# Altium schematic sheet Switch.SchDoc
size A; SheetNumber: 8; SheetTotal: 12
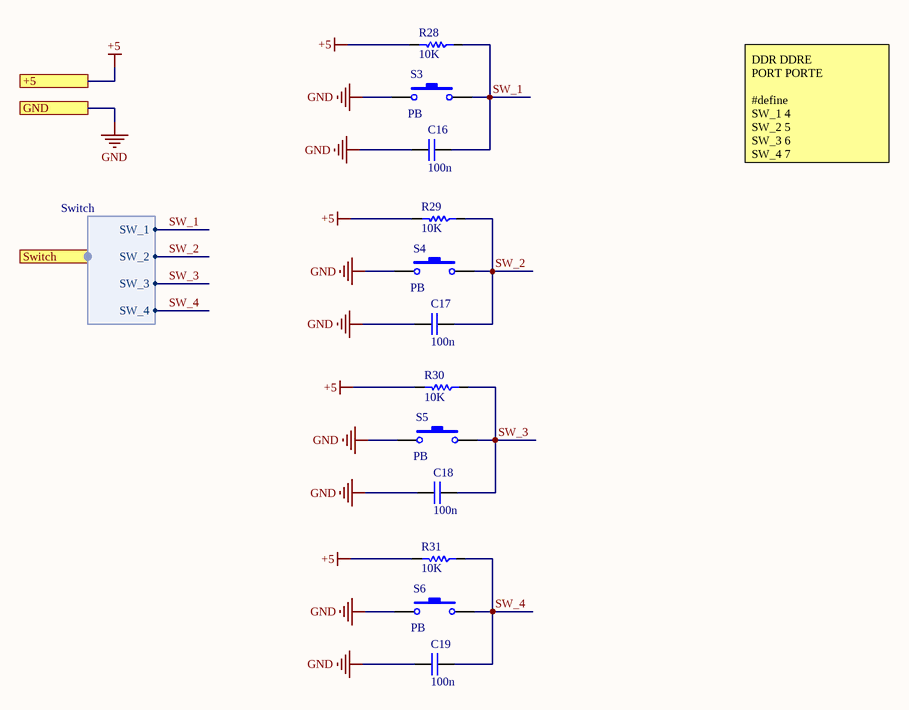
[diagram p0: Switch.SchDoc]

## Parts
C16  100n  [CAP 1206/3216]
C17  100n  [CAP 1206/3216]
C18  100n  [CAP 1206/3216]
C19  100n  [CAP 1206/3216]
R28  10K  [RES 1206 (3216X08L)]
R29  10K  [RES 1206 (3216X08L)]
R30  10K  [RES 1206 (3216X08L)]
R31  10K  [RES 1206 (3216X08L)]
S3  PB  [SW_PB_SMD_2PIN_SPST_6X3X2]
S4  PB  [SW_PB_SMD_2PIN_SPST_6X3X2]
S5  PB  [SW_PB_SMD_2PIN_SPST_6X3X2]
S6  PB  [SW_PB_SMD_2PIN_SPST_6X3X2]

## Ports
+5, GND, Switch (harness Switch)

## Harnesses
Switch: SW_1, SW_2, SW_3, SW_4

## Nets
+5: R28.2 R29.2 R30.2 R31.2 ; port +5
GND: C16.2 C17.2 C18.2 C19.2 S3.1 S4.1 S5.1 S6.1 ; port GND
SW_1: C16.1 R28.1 S3.2 ; port Switch.SW_1
SW_2: C17.1 R29.1 S4.2 ; port Switch.SW_2
SW_3: C18.1 R30.1 S5.2 ; port Switch.SW_3
SW_4: C19.1 R31.1 S6.2 ; port Switch.SW_4

## Notes on the sheet
- DDR DDRE
  PORT PORTE
  #define
  SW_1 4
  SW_2 5
  SW_3 6
  SW_4 7

## Library data of the parts
C16-C19 = Cap_Multi_SMD_100nF_1206: Bipolar ceramic capacitor SMD; Type: MultiLayer; Inflow: inflow?; Rating: 50V; Validation: Valid; Package: 1206; Value: 100n
R28-R31 = Res_SMD_1206: Resistor; Inflow: inflow?; Rating: 0.25W; Validation: Valid; Package: 1206; Type: 10%; Value: 10K
S3-S6 = SW_PushButton_2_SMD: SMT Tactile ‎Switch; Rating: 2b; Validation: Valid; Inflow: 8260; Type: Vertical; Package: SMD; Value: PB